# Altium project Urukul.PrjPCB (part 8 of 11)

## Sheet Power-up_delay.SchDoc: =DocumentName
size A4; DocumentNumber: 1; Revision: 0; SheetNumber: 3; SheetTotal: 20; Version: 1.6; Author 1: Grzegorz Kasprowicz; Author 2: Filip Światkowski, Paweł Kulik, Maciej Przybysz; Author 3: Krzysztof Belewicz; Github: https://github.com/sinara-hw/Urukul; Last modified by: Krzysztof Belewicz
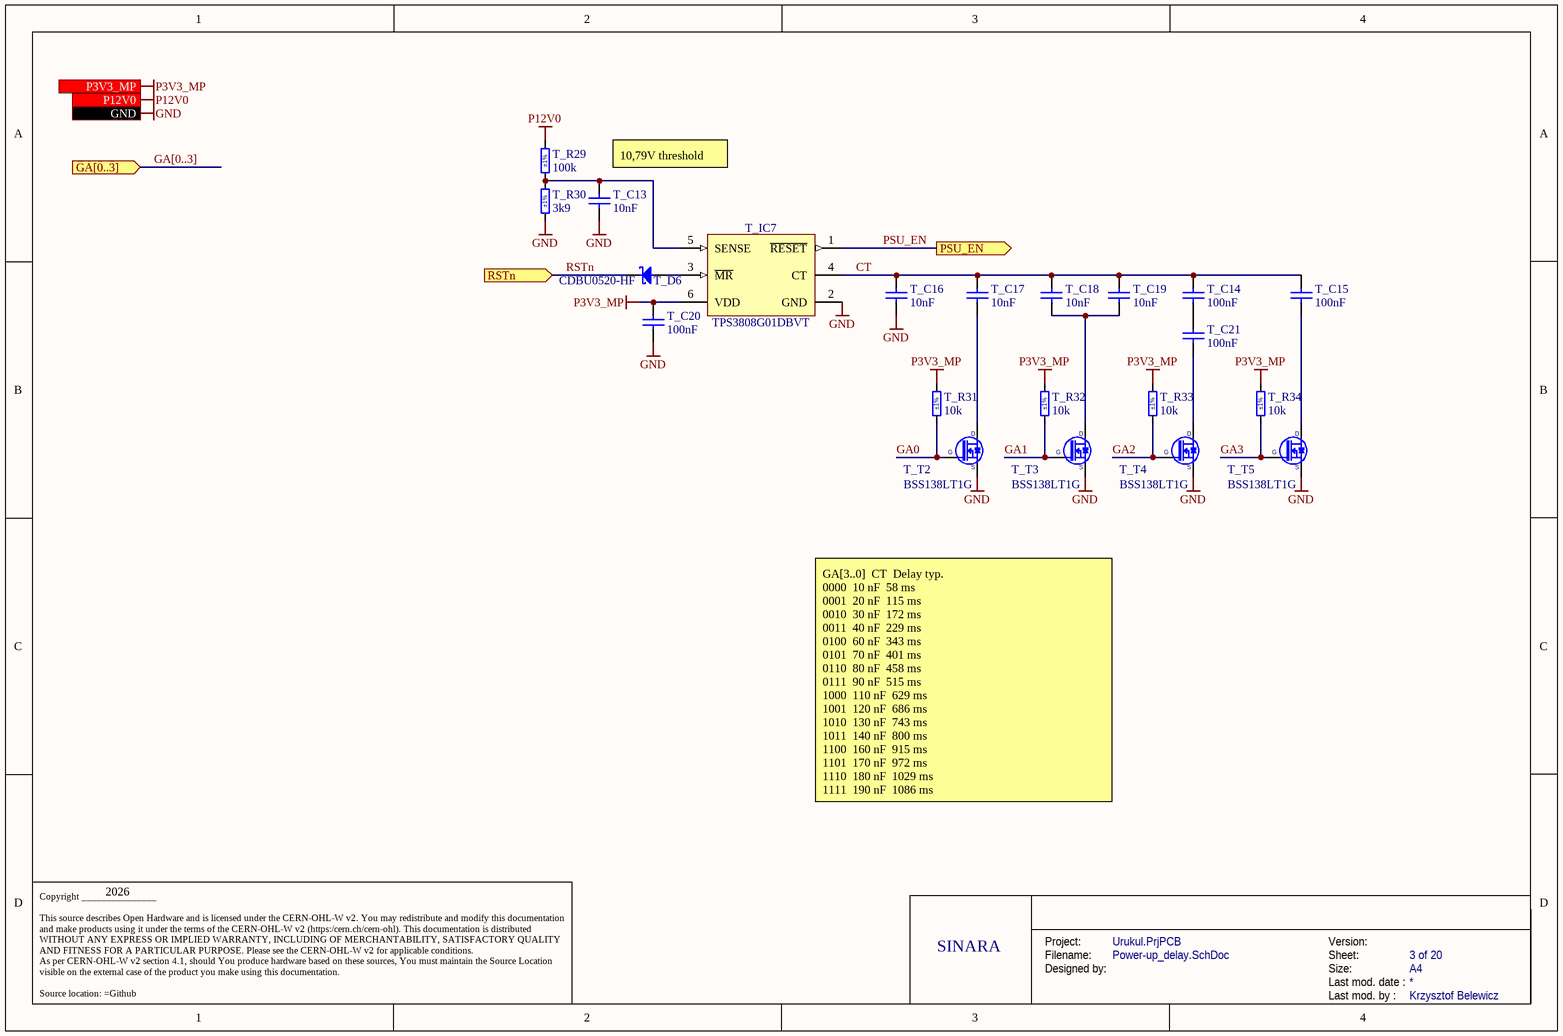
[diagram p17: Power-up_delay.SchDoc]

### Parts
T_C13  10nF  [CAPC1005X55N]
T_C14  100nF  [CAPC1005X55N]
T_C15  100nF  [CAPC1005X55N]
T_C16  10nF  [CAPC1005X55N]
T_C17  10nF  [CAPC1005X55N]
T_C18  10nF  [CAPC1005X55N]
T_C19  10nF  [CAPC1005X55N]
T_C20  100nF  [CAPC1005X55N]
T_C21  100nF  [CAPC1005X55N]
T_D6  CDBU0520-HF  [SOD-523F]
T_IC7  TPS3808G01DBVT  [SOT95P280X145-6N]
T_R29  100k  Tolerance: ±1%  [RESC1005X40N]
T_R30  3k9  Tolerance: ±1%  [RESC1005X40N]
T_R31  10k  Tolerance: ±1%  [RESC1005X40N]
T_R32  10k  Tolerance: ±1%  [RESC1005X40N]
T_R33  10k  Tolerance: ±1%  [RESC1005X40N]
T_R34  10k  Tolerance: ±1%  [RESC1005X40N]
T_T2  BSS138LT1G  [SOT95P240X110-3N]
T_T3  BSS138LT1G  [SOT95P240X110-3N]
T_T4  BSS138LT1G  [SOT95P240X110-3N]
T_T5  BSS138LT1G  [SOT95P240X110-3N]

### Ports
GA[0..3] (in), GND, P3V3_MP (in), P12V0 (in), PSU_EN (out), RSTn (in)

### Nets
GND: T_C13.2 T_C16.1 T_C20.1 T_IC7.2(GND) T_R30.1 T_T2.2(S) T_T3.2(S) T_T4.2(S) T_T5.2(S) ; port GND
P3V3_MP: T_C20.2 T_IC7.6(VDD) T_R31.2 T_R32.2 T_R33.2 T_R34.2 ; port P3V3_MP
P12V0: T_R29.1 ; port P12V0
CT: T_C14.2 T_C15.2 T_C16.2 T_C17.2 T_C18.2 T_C19.2 T_IC7.4(CT)
GA0: T_R31.1 T_T2.1(G)
GA1: T_R32.1 T_T3.1(G)
GA2: T_R33.1 T_T4.1(G)
GA3: T_R34.1 T_T5.1(G)
PSU_EN: T_IC7.1(~{RESET}) ; port PSU_EN
RSTn: T_D6.1(C) ; port RSTn
NetT_C13_1: T_C13.1 T_IC7.5(SENSE) T_R29.2 T_R30.2
NetT_C14_1: T_C14.1 T_C21.2
NetT_C15_1: T_C15.1 T_T5.3(D)
NetT_C17_1: T_C17.1 T_T2.3(D)
NetT_C18_1: T_C18.1 T_C19.1 T_T3.3(D)
NetT_C21_1: T_C21.1 T_T4.3(D)
NetT_D6_2: T_D6.2(A) T_IC7.3(~{MR})

### Buses and harness runs
bus GA[0..3] = port GA[0..3]

### Notes on the sheet
- (near T_C13) 10,79V threshold
- GA[3..0]		CT		Delay typ.
  0000		10 nF		58 ms
  0001		20 nF		115 ms
  0010		30 nF		172 ms
  0011		40 nF		229 ms
  0100		60 nF		343 ms
  0101		70 nF		401 ms
  0110		80 nF		458 ms
  0111		90 nF		515 ms
  1000		110 nF		629 ms
  1001		120 nF		686 ms
  1010		130 nF		743 ms
  1011		140 nF		800 ms
  1100		160 nF		915 ms
  1101		170 nF		972 ms
  1110		180 nF		1029 ms
  1111		190 nF		1086 ms
- 2026
- SINARA
- Project:
- Designed by:
- Filename:
- Size:
- Version:
- Last mod. date :
- Sheet:
- A4
- Copyright _______________
  This source describes Open Hardware and is licensed under the CERN-OHL-W v2. You may redistribute and modify this documentation and make products using it under the terms of the CERN-OHL-W v2 (https:/cern.ch/cern-ohl). This documentation is distributed WITHOUT ANY EXPRESS OR IMPLIED WARRANTY, INCLUDING OF MERCHANTABILITY, SATISFACTORY QUALITY AND FITNESS FOR A PARTICULAR PURPOSE. Please see the CERN-OHL-W v2 for applicable conditions.
  As per CERN-OHL-W v2 section 4.1, should You produce hardware based on these sources, You must maintain the Source Location visible on the external case of the product you make using this documentation.
  Source location: =Github
- Last mod. by :

### Library data of the parts
T_C13 T_C16-T_C19 = CC0402_10NF_16V_10%_X7R: Non-polarised capacitor; Part Description: SMD Multilayer Chip Ceramic Capacitor; Manufacturer: GENERIC; Manufacturer1 Part Number: 223878715636; Voltage: 16V; TC: X7R; Tolerance: ±10%; Part Number: CC0402_10NF_16V_10%_X7R; Component Kind: Standard; Component Type: Standard; Pin Count: 2; Value: 10nF; Status: Not Recommended; Manufacturer Part Number: CC0402_10NF_16V_10%_X7R; Case: 0402; Mounted: Yes; Socket: No; SMD: Yes; Sense: No; Manufacturer1 Example: PHYCOMP; Manufacturer1 ComponentHeight: 0.55mm; HelpURL: \\cern.ch\dfs\Applications\Altium\Datasheets\CC0402_X7R_PHYCOMP.pdf; Author: CERN DEM JLC; CreateDate: 2007-12-03; LatestRevisionDate: 2007-12-03
T_C14 T_C15 T_C20 T_C21 = CC0402_100NF_16V_10%_X5R: Non-polarised capacitor; Part Description: SMD Multilayer Chip Ceramic Capacitor; Manufacturer: GENERIC; Manufacturer1 Part Number: GRM155R61C104KA88D; Voltage: 16V; TC: X5R; Tolerance: ±10%; Part Number: CC0402_100NF_16V_10%_X5R; Component Kind: Standard; Component Type: Standard; Pin Count: 2; Value: 100nF; Status: None; Manufacturer Part Number: CC0402_100NF_16V_10%_X5R; Case: 0402; Mounted: Yes; Socket: No; SMD: Yes; Sense: No; Manufacturer1 Example: MURATA; Manufacturer1 ComponentHeight: 0.55mm; HelpURL: \\cern.ch\dfs\Applications\Altium\Datasheets\CC0402_X5R_MURATA_GRM.pdf; Author: CERN DEM JLC; CreateDate: 10.12.2013; LatestRevisionDate: 10.12.2013
T_D6 = CDBU0520-HF: Schottky Diode; Part Description: 20V Surface mount Schottky Barrier Diode; Manufacturer: COMCHIP; Voltage: 20V; Power: 500mA; PressFit: No; Bonding: No; Part Number: CDBU0520-HF; Component Kind: Standard; Component Type: Standard; Device: CDBU0520-HF; PackageDescription: Small Outline Diode Flat Lead (SOD-523F), Body; 1.80mm L X 1mm W X 0.85mm H; Manufacturer Part Number: CDBU0520-HF; Pin Count: 2; Case: SOD-523F; Mounted: Yes; Socket: No; SMD: Yes; Sense: No; ComponentHeight: 1mm; HelpURL: \\cern.ch\dfs\Applications\Altium\Datasheets\CDBU0520-HF.pdf; Author: CERN DEM HF; CreateDate: 13.10.2023; LatestRevisionDate: 13.10.2023
T_IC7 = TPS3808G01DBVT: Low Quiescent Current, Programmable-Delay Supervisory Circuit; Part Description: Adjustable Low Quiescent Current, Programmable-Delay Supervisory Circuit; Manufacturer: TEXAS INSTRUMENTS; PressFit: No; Bonding: No; Part Number: TPS3808G01DBVT; Component Kind: Standard; Component Type: Standard; Device: TPS3808G01DBVT; PackageDescription: SOT, 0.95mm Pitch; 6 Pin, 1.60mm W X 2.90mm L X 1.45mm H body, IPC Medium Density; Manufacturer Part Number: TPS3808G01DBV; Pin Count: 6; Case: SOT23-6; Mounted: Yes; Socket: No; SMD: Yes; Sense: No; ComponentHeight: 1.45mm; Author: CERN DEM JLC; HelpURL: \\cern.ch\dfs\Applications\Altium\Datasheets\TPS3808G01DBVT.pdf; CreateDate: 22.10.2008; LatestRevisionDate: 10.06.2022
T_R29 = R0402_100K_1%_0.0625W_100PPM: Resistor - 1%; Part Description: General Purpose Thick Film Chip Resistor; Manufacturer: GENERIC; Manufacturer1 Part Number: 232270671004L; TC: ±100ppm/°C; PressFit: No; Part Number: R0402_100K_1%_0.0625W_100PPM; Component Kind: Standard; Component Type: Standard; Pin Count: 2; Value: 100k; Status: Not Recommended; Power: 0.0625W; Manufacturer Part Number: R0402_100K_1%_0.0625W_100PPM; Case: 0402; Mounted: Yes; Sense: No; Socket: No; SMD: Yes; Manufacturer1 Example: YAGEO PHYCOMP; Manufacturer1 ComponentHeight: 0.4mm; HelpURL: \\cern.ch\dfs\Applications\Altium\Datasheets\R0402_Phycomp_RC0402.pdf; Author: CERN DEM JLC; CreateDate: 03.12.2007; LatestRevisionDate: 17.10.2012
T_R30 = R0402_3K9_1%_0.0625W_100PPM: Resistor - 1%; Part Description: General Purpose Thick Film Chip Resistor; Manufacturer: GENERIC; Manufacturer1 Part Number: 232270673902L; TC: ±100ppm/°C; PressFit: No; Part Number: R0402_3K9_1%_0.0625W_100PPM; Component Kind: Standard; Component Type: Standard; Pin Count: 2; Value: 3k9; Status: Not Recommended; Power: 0.0625W; Manufacturer Part Number: R0402_3K9_1%_0.0625W_100PPM; Case: 0402; Mounted: Yes; Sense: No; Socket: No; SMD: Yes; Manufacturer1 Example: YAGEO PHYCOMP; Manufacturer1 ComponentHeight: 0.4mm; HelpURL: \\cern.ch\dfs\Applications\Altium\Datasheets\R0402_Phycomp_RC0402.pdf; Author: CERN DEM JLC; CreateDate: 03.12.2007; LatestRevisionDate: 17.10.2012
T_R31-T_R34 = R0402_10K_1%_0.0625W_100PPM: Resistor - 1%; Part Description: General Purpose Thick Film Chip Resistor; Manufacturer: GENERIC; Manufacturer1 Part Number: 232270671003L; TC: ±100ppm/°C; PressFit: No; Part Number: R0402_10K_1%_0.0625W_100PPM; Component Kind: Standard; Component Type: Standard; Pin Count: 2; Value: 10k; Status: Not Recommended; Power: 0.0625W; Manufacturer Part Number: R0402_10K_1%_0.0625W_100PPM; Case: 0402; Mounted: Yes; Sense: No; Socket: No; SMD: Yes; Manufacturer1 Example: YAGEO PHYCOMP; Manufacturer1 ComponentHeight: 0.4mm; HelpURL: \\cern.ch\dfs\Applications\Altium\Datasheets\R0402_Phycomp_RC0402.pdf; Author: CERN DEM JLC; CreateDate: 03.12.2007; LatestRevisionDate: 17.10.2012
T_T2-T_T5 = BSS138LT1G: N-CHANNEL MOSFET WITH DIODE; Part Description: 50V, 200mA N-Channel Enhancement Mode Field-Effect Transistor; Manufacturer: ON SEMICONDUCTOR; PressFit: No; Bonding: No; Part Number: BSS138LT1G; Component Kind: Standard; Component Type: Standard; Device: BSS138LT1G; PackageDescription: SOT23, 0.95mm Pitch; 3 Pin, 1.40mm W X 3.00mm L X 1.10mm H body, IPC Medium Density; Manufacturer Part Number: BSS138L; Pin Count: 3; Case: SOT23-3; Mounted: Yes; Socket: No; SMD: Yes; Sense: No; ComponentHeight: 1.11mm; HelpURL: \\cern.ch\dfs\Applications\Altium\Datasheets\BSS138LT1G.pdf; Author: CERN DEM JLC; CreateDate: 23.03.2009; LatestRevisionDate: 25.05.2022